# EAGLE design Qwiic Environmental BME680 (EAGLE 9.6.0)
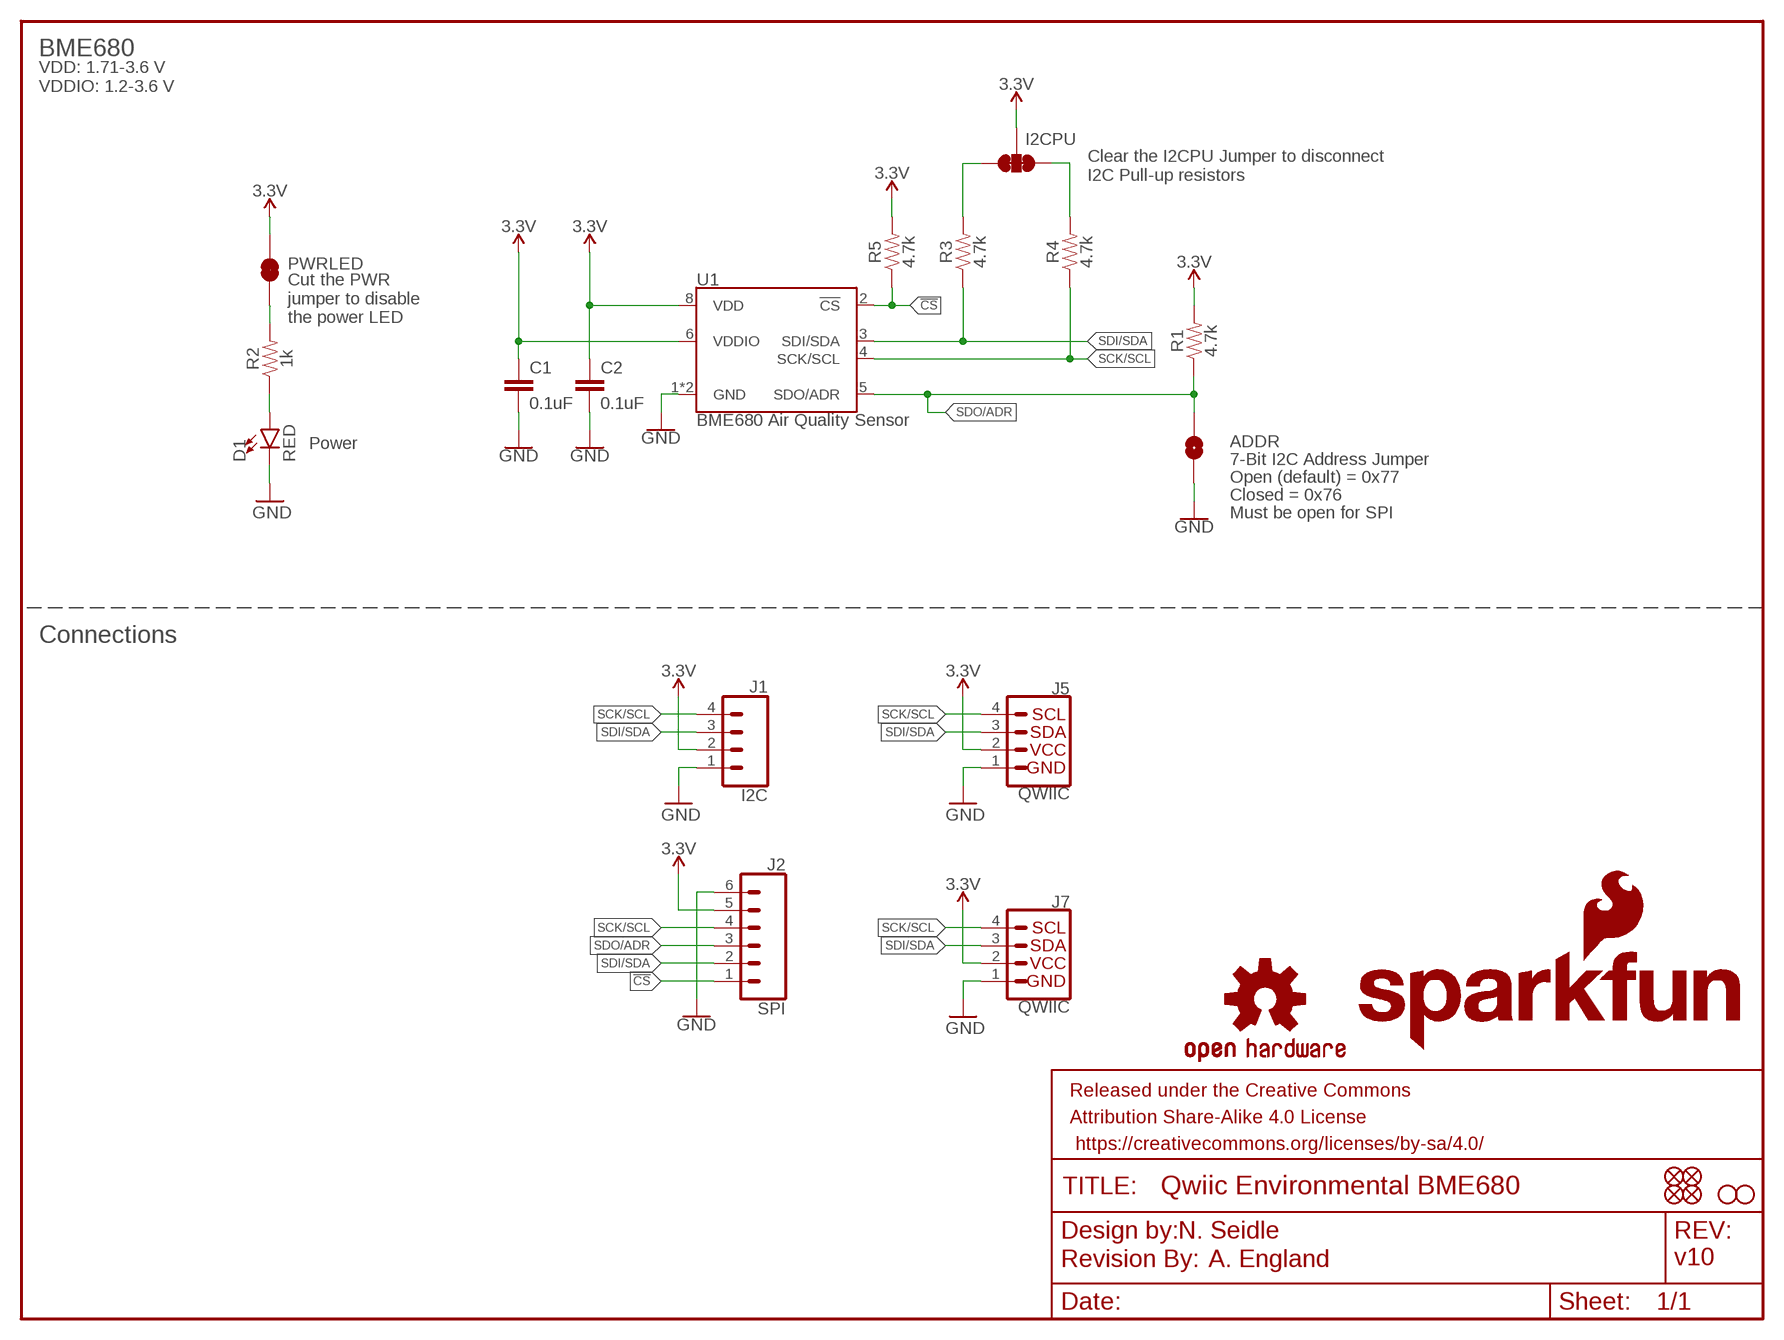
[diagram p0: schematic, sheet 1]

## Parts
ADDR  JUMPER-SMT_2_NO_SILK  [SMT-JUMPER_2_NO_SILK]
C1  0.1uF  0.1UF-0603-100V-10%  [0603]
C2  0.1uF  0.1UF-0603-100V-10%  [0603]
D1  RED  LED-RED0603  [LED-0603]
FD1  FIDUCIALUFIDUCIAL  [FIDUCIAL-MICRO]
FD2  FIDUCIALUFIDUCIAL  [FIDUCIAL-MICRO]
FD3  FIDUCIALUFIDUCIAL  [FIDUCIAL-MICRO]
FD4  FIDUCIALUFIDUCIAL  [FIDUCIAL-MICRO]
FRAME1  FRAME-LETTER  [CREATIVE_COMMONS]
H1  STAND-OFFTIGHT  [STAND-OFF-TIGHT]
H2  STAND-OFFTIGHT  [STAND-OFF-TIGHT]
I2CPU  I2C PU  JUMPER-SMT_3_2-NC_TRACE_SILK  [SMT-JUMPER_3_2-NC_TRACE_SILK]
J1  I2C  CONN_041X04_NO_SILK  [1X04_NO_SILK]
J2  SPI  CONN_06NO_SILK_FEMALE_PTH  [1X06_NO_SILK]
J5  QWIIC  QWIIC_CONNECTORJS-1MM  [JST04_1MM_RA]
J7  QWIIC  QWIIC_CONNECTORJS-1MM  [JST04_1MM_RA]
LOGO1  OSHW-LOGOMINI  [OSHW-LOGO-MINI]
LOGO2  SFE_LOGO_NAME_FLAME.1_INCH  [SFE_LOGO_NAME_FLAME_.1]
LOGO3  REVISION  [REVISION]
LOGO4  SFE_LOGO_FLAME.1_INCH  [SFE_LOGO_FLAME_.1]
PWRLED  JUMPER-SMT_2_NC_TRACE_SILK  [SMT-JUMPER_2_NC_TRACE_SILK]
R1  4.7k  4.7KOHM-0603-1/10W-1%  [0603@1]
R2  1k  1KOHM-0603-1/10W-1%  [0603]
R3  4.7k  4.7KOHM-0603-1/10W-1%  [0603@1]
R4  4.7k  4.7KOHM-0603-1/10W-1%  [0603@1]
R5  4.7k  4.7KOHM-0603-1/10W-1%  [0603@1]
U1  BME680 Air Quality Sensor  BME680-LGA  [LGA3.0X3.0]

## Nets
3.3V: C1.1 C2.1 I2CPU.2 J1.2 J2.5 J5.2 J7.2 PWRLED.2 R1.2 R5.2 U1.6(VDDIO) U1.8(VDD)
!CS: J2.1 R5.1 U1.2(!CS)
GND: ADDR.1 C1.2 C2.2 D1.C J1.1 J2.6 J5.1 J7.1 U1.1(GND) U1.7(GND)
N$1: PWRLED.1 R2.2
N$3: D1.A R2.1
N$4: I2CPU.3 R3.2
N$5: I2CPU.1 R4.2
SCK/SCL: J1.4 J2.4 J5.4 J7.4 R4.1 U1.4(SCK/SCL)
SDI/SDA: J1.3 J2.2 J5.3 J7.3 R3.1 U1.3(SDI/SDA)
SDO/ADR: ADDR.2 J2.3 R1.1 U1.5(SDO/ADR)

## Notes on the sheet
- BME680
- VDD: 1.71-3.6 V
  VDDIO: 1.2-3.6 V
- Clear the I2CPU Jumper to disconnect
  I2C Pull-up resistors
- Cut the PWR
  jumper to disable
  the power LED
- Power
- 7-Bit I2C Address Jumper
- Open (default) = 0x77
- Closed = 0x76
- Must be open for SPI
- Connections
- N. Seidle
- A. England | v10

## Library data of the parts
ADDR = SparkFun-Jumpers:JUMPER-SMT_2_NO: Normally open jumper This jumper has two pads in close proximity to each other. Apply solder to close the connection. Round pads are easier to solder for beginners, but are a lot larger. SparkFun Product that uses the round pads: SparkFun EL Sequencer <https://www.sparkfun.com/products/12781>
C1 C2 = SparkFun-Capacitors:0.1UF: 0.1µF ceramic capacitors A capacitor is a passive two-terminal electrical component used to store electrical energy temporarily in an electric field.; PROD_ID: CAP-08390
D1 = SparkFun-LED:LED-RED: Red SMD LED Used in manufacturing of most products at SparkFun Packages: 0603 - SMD 0603 package [Product Link] <http://docs.avagotech.com/docs/AV02-0551EN> 0603 SMART - SMD 0603 SMART package ( more efficient and expensive)[Product Link] <http://www.osram-os.com/Graphics/XPic2/00077099_0.pdf> 1206 - SMD1206 package [Product Link] <https://www.sparkfun.com/datasheets/DevTools/LilyPad/Q150OVS4.pdff> SparkFun Products: Pro Mini 328 -5V <https://www.sparkfun.com/products/821> RedBoard <https://www.sparkfun.com/products/12757> IOIO-OTG <https://www.sparkfun.com/products/13613>; PROD_ID: DIO-00819
FD1-FD4 = SparkFun-Aesthetics:FIDUCIAL: Fiducial Alignment Points Point-of-reference for pick-and-place machines and other optical instruments.
FRAME1 = SparkFun-Aesthetics:FRAME-LETTER: Schematic Frame - Letter Standard 8.5x11 US Letter frame
H1 H2 = SparkFun-Hardware:STAND-OFF: Stand Off Drill holes for mechanically mounting via screws, standoffs, etc. Note: Use the keepout ring to avoid running the screw head into surrounding components. Variant Overviews STAND-OFF - Mechanical footprint for a #4 phillips button head screw. STAND-OFF-TIGHT - Mechanical footprint for a #4 phillips button head screw, Example SparkFun Products Screw - Phillips Head (1/4", 4-40, 10 pack) <https://www.sparkfun.com/products/10453> (PRT-10453) Screw - Phillips Head (1/2", 4-40, 10 pack) <https://www.sparkfun.com/products/10452> (PRT-10452) Screw - Phillips Head (3/4", 4-40, 10 pack) <https://www.sparkfun.com/products/10451> (PRT-10451) Screw - Phillips Head (1", 4-40, 10 pack) <https://www.sparkfun.com/products/10450> (PRT-10450)
I2CPU = SparkFun-Jumpers:JUMPER-SMT_3_2-NC_TRACE: Normally closed trace jumper (2 of 2 connections) This jumper has a trace between all three pads so they are normally closed (NC). Use a razor knife to open the connection(s). For best results follow the IPC guidelines for cutting traces: Cutout at least 0.063 mm (0.005 in). Remove all loose material to clean up the cut area. Seal the cut with an approved epoxy. Reapply solder to reclose the connection(s).
J1 = SparkFun-Connectors:CONN_04: Multi connection point. Often used as Generic Header-pin footprint for 0.1 inch spaced/style header connections On any of the 0.1 inch spaced packages, you can populate with these: Break Away Headers - Straight <https://www.sparkfun.com/products/116> (PRT-00116) Break Away Male Headers - Right Angle <https://www.sparkfun.com/products/553> (PRT-00553) Female Headers <https://www.sparkfun.com/products/115> (PRT-00115) Break Away Headers - Machine Pin <https://www.sparkfun.com/products/117> (PRT-00117) Break Away Female Headers - Swiss Machine Pin <https://www.sparkfun.com/products/743> (PRT-00743) For SCREWTERMINALS and SPRING TERMINALS visit here: Screw Terimnals on SparkFun.com <https://www.sparkfun.com/search/results?term=Screw+Terminals> (5mm/3.5mm/2.54mm spacing) This device is also useful as a general connection point to wire up your design to another part of your project. Our various solder wires solder well into these plated through hole pads. Hook-Up Wire - Assortment (Stranded, 22 AWG) <https://www.sparkfun.com/products/11375> (PRT-11375) Hook-Up Wire - Assortment (Solid Core, 22 AWG) <https://www.sparkfun.com/products/11367> (PRT-11367) View the entire wire category on our website here <https://www.sparkfun.com/categories/141> Special notes: Molex polarized connector foot print use with SKU : PRT-08231 with associated crimp pins and housings. 1MM SMD Version SKU: PRT-10208; PROD_ID: CONN-09696
J2 = SparkFun-Connectors:CONN_06: Multi connection point. Often used as Generic Header-pin footprint for 0.1 inch spaced/style header connections On any of the 0.1 inch spaced packages, you can populate with these: Break Away Headers - Straight <https://www.sparkfun.com/products/116> (PRT-00116) Break Away Male Headers - Right Angle <https://www.sparkfun.com/products/553> (PRT-00553) Female Headers <https://www.sparkfun.com/products/115> (PRT-00115) Break Away Headers - Machine Pin <https://www.sparkfun.com/products/117> (PRT-00117) Break Away Female Headers - Swiss Machine Pin <https://www.sparkfun.com/products/743> (PRT-00743) Arduino Stackable Header - 6 Pin <https://www.sparkfun.com/products/9280> (PRT-09280) For SCREWTERMINALS and SPRING TERMINALS visit here: Screw Terimnals on SparkFun.com <https://www.sparkfun.com/search/results?term=Screw+Terminals> (5mm/3.5mm/2.54mm spacing) This device is also useful as a general connection point to wire up your design to another part of your project. Our various solder wires solder well into these plated through hole pads. Hook-Up Wire - Assortment (Stranded, 22 AWG) <https://www.sparkfun.com/products/11375> (PRT-11375) Hook-Up Wire - Assortment (Solid Core, 22 AWG) <https://www.sparkfun.com/products/11367> (PRT-11367) View the entire wire category on our website here <https://www.sparkfun.com/categories/141>; PROD_ID: CONN-08437
J5 J7 = SparkFun-Connectors:QWIIC_CONNECTOR: SparkFun I2C Standard Qwiic Connector An SMD 1mm pitch JST connector makes it easy and quick (get it? Qwiic?) to connect I2C devices to each other. The Qwiic system <http://www.sparkfun.com/qwiic> enables fast and solderless connection between popular platforms and various sensors and actuators. We carry 200mm <https://www.sparkfun.com/products/14204>, 100mm <https://www.sparkfun.com/products/14205>, 50mm <https://www.sparkfun.com/products/14206>, and breadboard friendly <https://www.sparkfun.com/products/14207> Qwiic cables. We also offer 10 pcs strips <https://www.sparkfun.com/products/14323> the SMD connectors.; PROD_ID: CONN-13694; VALUE: QWIIC_RIGHT_ANGLE
LOGO1 = SparkFun-Aesthetics:OSHW-LOGO: Open-Source Hardware (OSHW) Logo This logo indicates the piece of hardware it is found on incorporates a OSHW license and/or adheres to the definition of open source hardware found here: http://freedomdefined.org/OSHW
LOGO2 = SparkFun-Aesthetics:SFE_LOGO_NAME_FLAME: SparkFun Font Logo w/ Flame This is the SparkFun full logo. The logo on the schematic will always be the same size; the package variant is the height of the flame part of the logo. Default layer for the logo on the board is tSilk.
LOGO3 = SparkFun-Aesthetics:REVISION: "Revision By" Text Preceding text for revisor documentation. Includes schematic text on "symbols" layer, and board text on tDoc.
LOGO4 = SparkFun-Aesthetics:SFE_LOGO_FLAME: SparkFun Flame Logo This is the SparkFun flame logo. The logo on the schematic will always be the same size; the package variant is the height of the flame. Default layer for the logo on the board is tSilk.
PWRLED = SparkFun-Jumpers:JUMPER-SMT_2_NC_TRACE: Normally closed trace jumper This jumper has a trace between two pads so it's normally closed (NC). Use a razor knife to open the connection. For best results follow the IPC guidelines for cutting traces: Cutout at least 0.063 mm (0.005 in). Remove all loose material to clean up the cut area. Seal the cut with an approved epoxy. Reapply solder to reclose the connection.
R1 R3-R5 = SparkFun-Resistors:4.7KOHM: 4.7kΩ resistor A resistor is a passive two-terminal electrical component that implements electrical resistance as a circuit element. Resistors act to reduce current flow, and, at the same time, act to lower voltage levels within circuits. - Wikipedia; PROD_ID: RES-07857
R2 = SparkFun-Resistors:1KOHM: 1kΩ resistor A resistor is a passive two-terminal electrical component that implements electrical resistance as a circuit element. Resistors act to reduce current flow, and, at the same time, act to lower voltage levels within circuits. - Wikipedia; PROD_ID: RES-07856
U1 = SparkFun-Sensors:BME680: Bosch BME680 – Combined Humidity and Pressure Sensor The BME680 is as combined digital humidity, pressure and temperature sensor based on proven sensing principles. The sensor module is housed in an extremely compact metal-lid LGA package with a footprint of only 3.0×3.0mm with a height of 0.93mm. Its small dimensions and its low power consumption allow the implementation in battery driven devices such as handsets, GPS modules or watches.; PROD_ID: IC-14656; VALUE: BME680

## Board
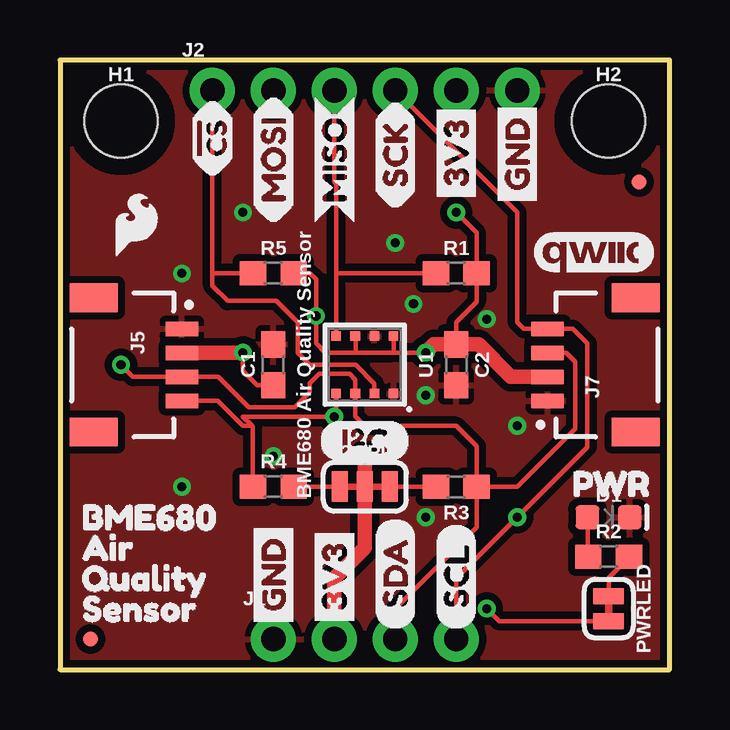
[diagram p1: board, top side]
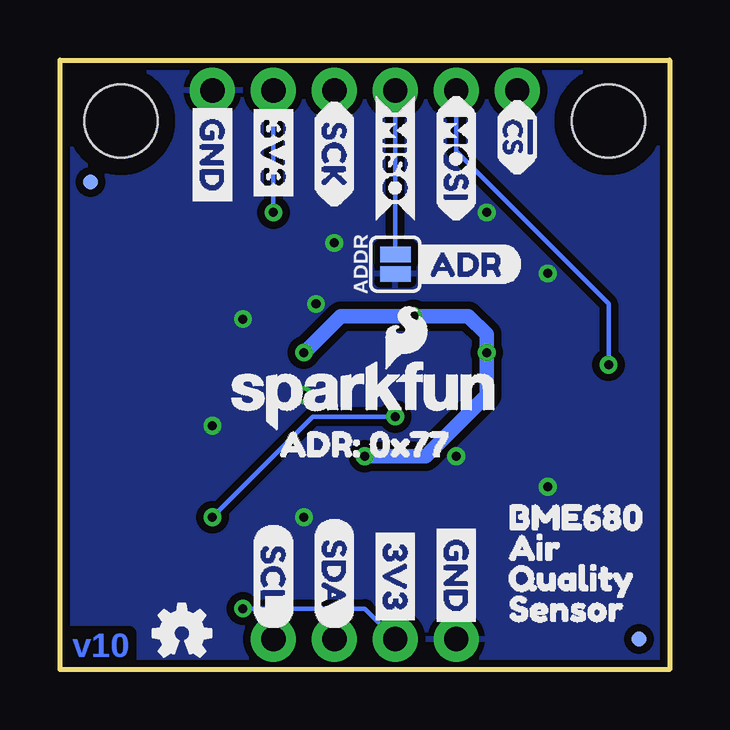
[diagram p2: board, bottom side, seen from below]

Size 25.4 x 25.4 mm. Coordinates in mm from the lower left corner, seen from the top.
Outline: 0,0 25.4,0 25.4,25.4 0,25.4 0,0
Copper layers (1*16): Top 0.035mm / dielectric 1.5mm / Bottom 0.035mm
Design rules "SparkFun-2-layer-TIGHT": minimum track width 7mil, minimum drill 15mil, track to track 7mil, track to pad 7mil, pad to pad 7mil, via to via 7mil, smd to smd 7mil, copper to edge 7mil, drill to drill 7mil, minimum pad ring 7mil, minimum via ring 7mil, stop-mask expansion 4mil, vias tented up to drill 25mil, thermal gap 10mil

### Footprints (pad centres in the part's own frame; a part is rotated, then mirrored left to right if it is on the bottom)
SMT-JUMPER_2_NO_SILK = smd 0.635 x 1.27: 1 -0.406,0; 2 0.406,0
0603 = smd 1.1 x 1: 1 -0.85,0; 2 0.85,0
LED-0603 = smd 1 x 1: A -0.877,0; C 0.877,0
FIDUCIAL-MICRO = smd 0.635 x 0.635: 1 0,0
STAND-OFF-TIGHT = hole 3.048: 0,0
SMT-JUMPER_3_2-NC_TRACE_SILK = smd 0.66 x 1.27: 1 -1.041,0; 2 0,0; 3 1.041,0
1X04_NO_SILK = drill 1.016 pad 1.88: 1 0,0; 2 2.54,0; 3 5.08,0; 4 7.62,0
1X06_NO_SILK = drill 1.016 pad 1.88: 1 0,0; 2 2.54,0; 3 5.08,0; 4 7.62,0; 5 10.16,0; 6 12.7,0
JST04_1MM_RA = smd 0.6 x 1.35: 1 -1.5,0; 2 -0.5,0; 3 0.5,0; 4 1.5,0 | smd 1.2 x 2: NC1 2.8,-3.675; NC2 -2.8,-3.675
SMT-JUMPER_2_NC_TRACE_SILK = smd 0.66 x 1.27: 1 -0.521,0; 2 0.521,0
0603@1 = smd 1.1 x 1: 1 -0.85,0; 2 0.85,0
LGA3.0X3.0 = smd 0.4 x 0.4: 1 1.2,1.2; 2 1.2,0.4; 3 1.2,-0.4; 4 1.2,-1.2; 5 -1.2,-1.2; 6 -1.2,-0.4; 7 -1.2,0.4; 8 -1.2,1.2

### Placement (x,y rotation side)
ADDR  11.43,16.89 90 bottom
C1  8.89,12.7 90 top
C2  16.51,12.7 270 top
D1  22.86,6.35 0 top
FD1  24.13,20.32 0 top
FD2  24.13,20.32 0 bottom
FD3  1.27,1.27 0 bottom
FD4  1.27,1.27 0 top
FRAME1  -16.51,-10.16 0 top  (outside the outline)
H1  2.54,22.86 0 top
H2  22.86,22.86 0 top
I2CPU  12.7,7.62 0 top
J1  8.89,1.27 0 top
J2  6.35,24.13 0 top
J5  5.08,12.7 270 top
J7  20.32,12.7 90 top
LOGO1  20.32,1.52 0 bottom
LOGO2  12.7,11.43 0 bottom
LOGO3  -5.08,-12.7 0 top  (outside the outline)
LOGO4  3.17,18.54 0 top
PWRLED  22.86,2.54 270 top
R1  16.51,16.51 0 top
R2  22.86,4.7 0 top
R3  16.51,7.62 180 top
R4  8.89,7.62 0 top
R5  8.89,16.51 0 top
U1  12.7,12.7 270 top
U$1  [MISO_O]  11.43,18.54 90 top
U$2  [MISO_O]  11.43,24 270 bottom
U$3  [!CS_I]  6.35,20.32 90 top
U$4  [!CS_I]  6.35,24 270 bottom
U$5  [MOSI_I]  8.89,18.54 90 top
U$6  [MOSI_I]  8.89,24 270 bottom
U$7  [SCK_I]  13.97,19.18 90 top
U$8  [SCK_I]  13.97,23.75 270 bottom
U$9  [3V3_P]  16.51,19.18 90 top
U$10  [3V3_P]  16.51,23.88 270 bottom
U$11  [GND_P]  19.05,19.05 90 top
U$12  [GND_P]  19.05,23.88 270 bottom
U$13  [GND_P]  8.89,6.35 270 bottom
U$14  [GND_P]  8.89,1.52 90 top
U$15  [I2C]  10.79,9.53 0 top
U$16  [3V3_P]  11.43,1.52 90 top
U$17  [3V3_P]  11.43,6.22 270 bottom
U$18  [SDA_IO]  13.97,1.65 90 top
U$19  [SDA_IO]  13.97,6.35 270 bottom
U$20  [SCL_IO]  16.51,1.65 90 top
U$21  [SCL_IO]  16.51,6.1 270 bottom
U$22  [BME6800]  0,6.35 0 top
U$23  [AIR1]  0,5.08 0 top
U$24  [QUALITY2]  0,3.81 0 top
U$25  [SENSOR3]  0,2.54 0 top
U$26  [BME6800]  7.62,6.35 0 bottom
U$27  [AIR1]  7.62,5.08 0 bottom
U$28  [QUALITY2]  7.62,3.81 0 bottom
U$29  [SENSOR3]  7.62,2.54 0 bottom
U$30  [ADR4]  10.92,16.89 0 bottom
U$32  [QWIIC_5MM]  22.23,17.4 0 top
U$33  [ADR#_0X770]  17.14,9.4 0 bottom
U$34  [PWR_TO]  20.45,7.75 0 top

### Tracks (layer width: path | path; a pad name or v marks a point on that pad's centre or on a via)
3.3V  (via drill 0.38)
  Top 0.178: J5.2 | 12.32,13.21 11.05,13.21 10.67,13.59 v10.67,14.73 10.67,16.26 10.41,16.51 R5.2 | 12.32,13.21 13.84,13.21 | 13.84,13.21 13.9,13.27 U1.8 | v7.62,13.21 7.62,12.45 8.22,11.85 C1.1 | v16.51,19.05 17.36,18.2 R1.2 17.36,15.33 16.51,14.48 C2.1 | v15.24,13.21 13.84,13.21 | U1.6 12.32,13.88 12.32,13.21 | PWRLED.2 18.3,2.02 v17.78,2.54
  Top 0.61: v7.62,13.21 J5.2 | v15.24,13.21 15.58,13.55 C2.1 17.44,13.55 18.79,12.2 J7.2 | v12.7,8.89 I2CPU.2 12.7,5.08 11.43,3.81 J1.2
  Bottom 0.178: J2.5 v16.51,19.05 | v17.78,2.54 12.7,2.54 J1.2 | v15.23,13.21 v15.24,13.21
  Bottom 0.61: v12.7,8.89 10.16,8.89 7.62,11.43 v7.62,13.21 7.62,13.97 8.38,14.73 v10.67,14.73 13.71,14.73 v15.23,13.21
!CS
  Top 0.178: 6.35,16.51 6.35,16 6.99,15.37 9.02,15.37 9.91,14.48 9.91,13.21 10.41,12.7 12.32,12.7 13.1,11.92 U1.2 | 6.35,16.51 J2.1 | R5.1 6.35,16.51
GND  (via drill 0.38)
  other vias: 5.08,16.51 15.24,11.43 19.05,10.16 14.73,15.24 8.89,8.89 15.24,6.35 13.97,17.78 7.62,19.05 17.78,14.61 5.08,7.62
  pour Top (isolate 0.305): 0,25.4 25.4,25.4 25.4,0 0,0
  pour Bottom (isolate 0.305): 25.4,25.4 0,25.4 0,0 25.4,0
N$1
  Top 0.178: R2.2 23.71,4.67 22.86,3.82 PWRLED.1
N$3
  Top 0.178: D1.A 21.98,4.73 R2.1
N$4
  Top 0.178: I2CPU.3 R3.2
N$5
  Top 0.178: R4.2 I2CPU.1
SCK/SCL  (via drill 0.38)
  Top 0.178: J5.4 6.58,11.2 7.62,10.16 8,10.16 | J2.4 19.05,19.05 19.05,14.48 19.33,14.2 J7.4 21.36,14.2 21.97,13.59 21.97,9.27 v19.05,6.35 16.51,3.81 J1.4 | R4.1 8.04,10.12 8,10.16 | 8,10.16 7.62,10.54 v11.43,10.54 11.5,10.54 U1.4
  Bottom 0.178: v11.43,10.54 14.86,10.54 v19.05,6.35
SDI/SDA  (via drill 0.38)
  Top 0.178: R3.1 17.36,9.31 16.51,10.16 12.7,10.16 12.3,10.56 U1.3 12.3,12.08 12.06,12.32 10.79,12.32 10.41,11.94 10.41,11.56 9.78,10.92 7.87,10.92 6.6,12.2 J5.3 3.04,12.2 v2.54,12.7 | R3.1 17.36,5.93 13.97,2.54 J1.3 | J7.3 21.09,13.2 21.46,12.83 21.46,10.03 19.05,7.62 R3.1
  Bottom 0.178: J2.2 8.89,21.59 2.54,15.24 v2.54,12.7
SDO/ADR
  Top 0.178: 11.5,16.51 11.5,20.25 11.43,20.32 J2.3 | R1.1 11.5,16.51 | U1.5 11.5,16.51
  Bottom 0.178: ADDR.2 J2.3

### Text on the board
Bottom: v10
Measures: Units in Inches
tDocu: N. Seidle | A. England